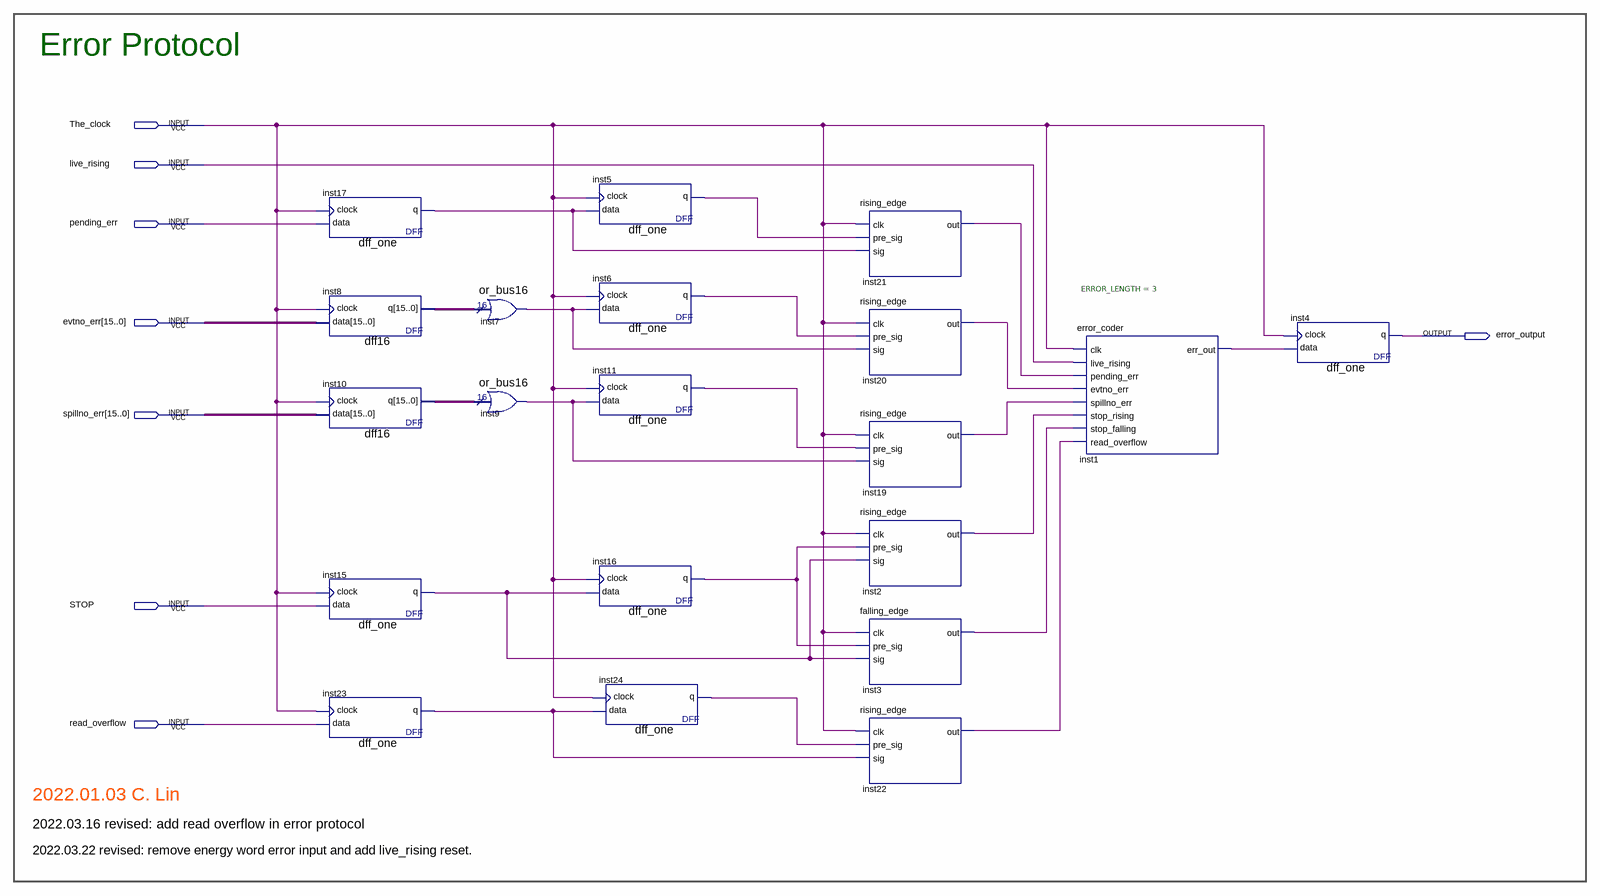
[diagram p0: schematic sheet]
// Quartus schematic error_protocol.bdf as structural Verilog: 20 symbols, 8 pins
module error_protocol (
  input  The_clock,
  input  live_rising,
  input  pending_err,
  input  [15:0] evtno_err,
  input  [15:0] spillno_err,
  input  STOP,
  input  read_overflow,
  output error_output
);

  wire inst1_err_out, inst2_out, inst3_out, inst5_q, inst6_q, inst7_result, inst9_result, inst11_q, inst15_q,
       inst16_q, inst17_q, inst19_out, inst20_out, inst21_out, inst22_out, inst23_q, inst24_q;
  wire [15:0] inst8_q, inst10_q;

  dff_one inst17 (.data(pending_err), .clock(The_clock), .q(inst17_q));
  dff16 inst8 (.data(evtno_err), .clock(The_clock), .q(inst8_q));
  dff16 inst10 (.data(spillno_err), .clock(The_clock), .q(inst10_q));
  dff_one inst15 (.data(STOP), .clock(The_clock), .q(inst15_q));
  dff_one inst23 (.data(read_overflow), .clock(The_clock), .q(inst23_q));
  or_bus16 inst7 (.data(inst8_q), .result(inst7_result));
  or_bus16 inst9 (.data(inst10_q), .result(inst9_result));
  dff_one inst5 (.data(inst17_q), .clock(The_clock), .q(inst5_q));
  dff_one inst6 (.data(inst7_result), .clock(The_clock), .q(inst6_q));
  dff_one inst11 (.data(inst9_result), .clock(The_clock), .q(inst11_q));
  dff_one inst16 (.data(inst15_q), .clock(The_clock), .q(inst16_q));
  dff_one inst24 (.data(inst23_q), .clock(The_clock), .q(inst24_q));
  rising_edge inst21 (.clk(The_clock), .pre_sig(inst5_q), .sig(inst17_q), .out(inst21_out));
  rising_edge inst20 (.clk(The_clock), .pre_sig(inst6_q), .sig(inst7_result), .out(inst20_out));
  rising_edge inst19 (.clk(The_clock), .pre_sig(inst11_q), .sig(inst9_result), .out(inst19_out));
  rising_edge inst2 (.clk(The_clock), .pre_sig(inst16_q), .sig(inst15_q), .out(inst2_out));
  falling_edge inst3 (.clk(The_clock), .pre_sig(inst16_q), .sig(inst15_q), .out(inst3_out));
  rising_edge inst22 (.clk(The_clock), .pre_sig(inst24_q), .sig(inst23_q), .out(inst22_out));
  error_coder #(.ERROR_LENGTH(3)) inst1 (
    .clk(The_clock), .live_rising(live_rising), .pending_err(inst21_out), .evtno_err(inst20_out),
    .spillno_err(inst19_out), .stop_rising(inst2_out), .stop_falling(inst3_out), .read_overflow(inst22_out),
    .err_out(inst1_err_out));
  dff_one inst4 (.data(inst1_err_out), .clock(The_clock), .q(error_output));

  // Notes on the sheet:
  //   Error Protocol
  //   2022.01.03 C. Lin
  //   2022.03.16 revised: add read overflow in error protocol
  //   2022.03.22 revised: remove energy word error input and add live_rising reset.
endmodule
